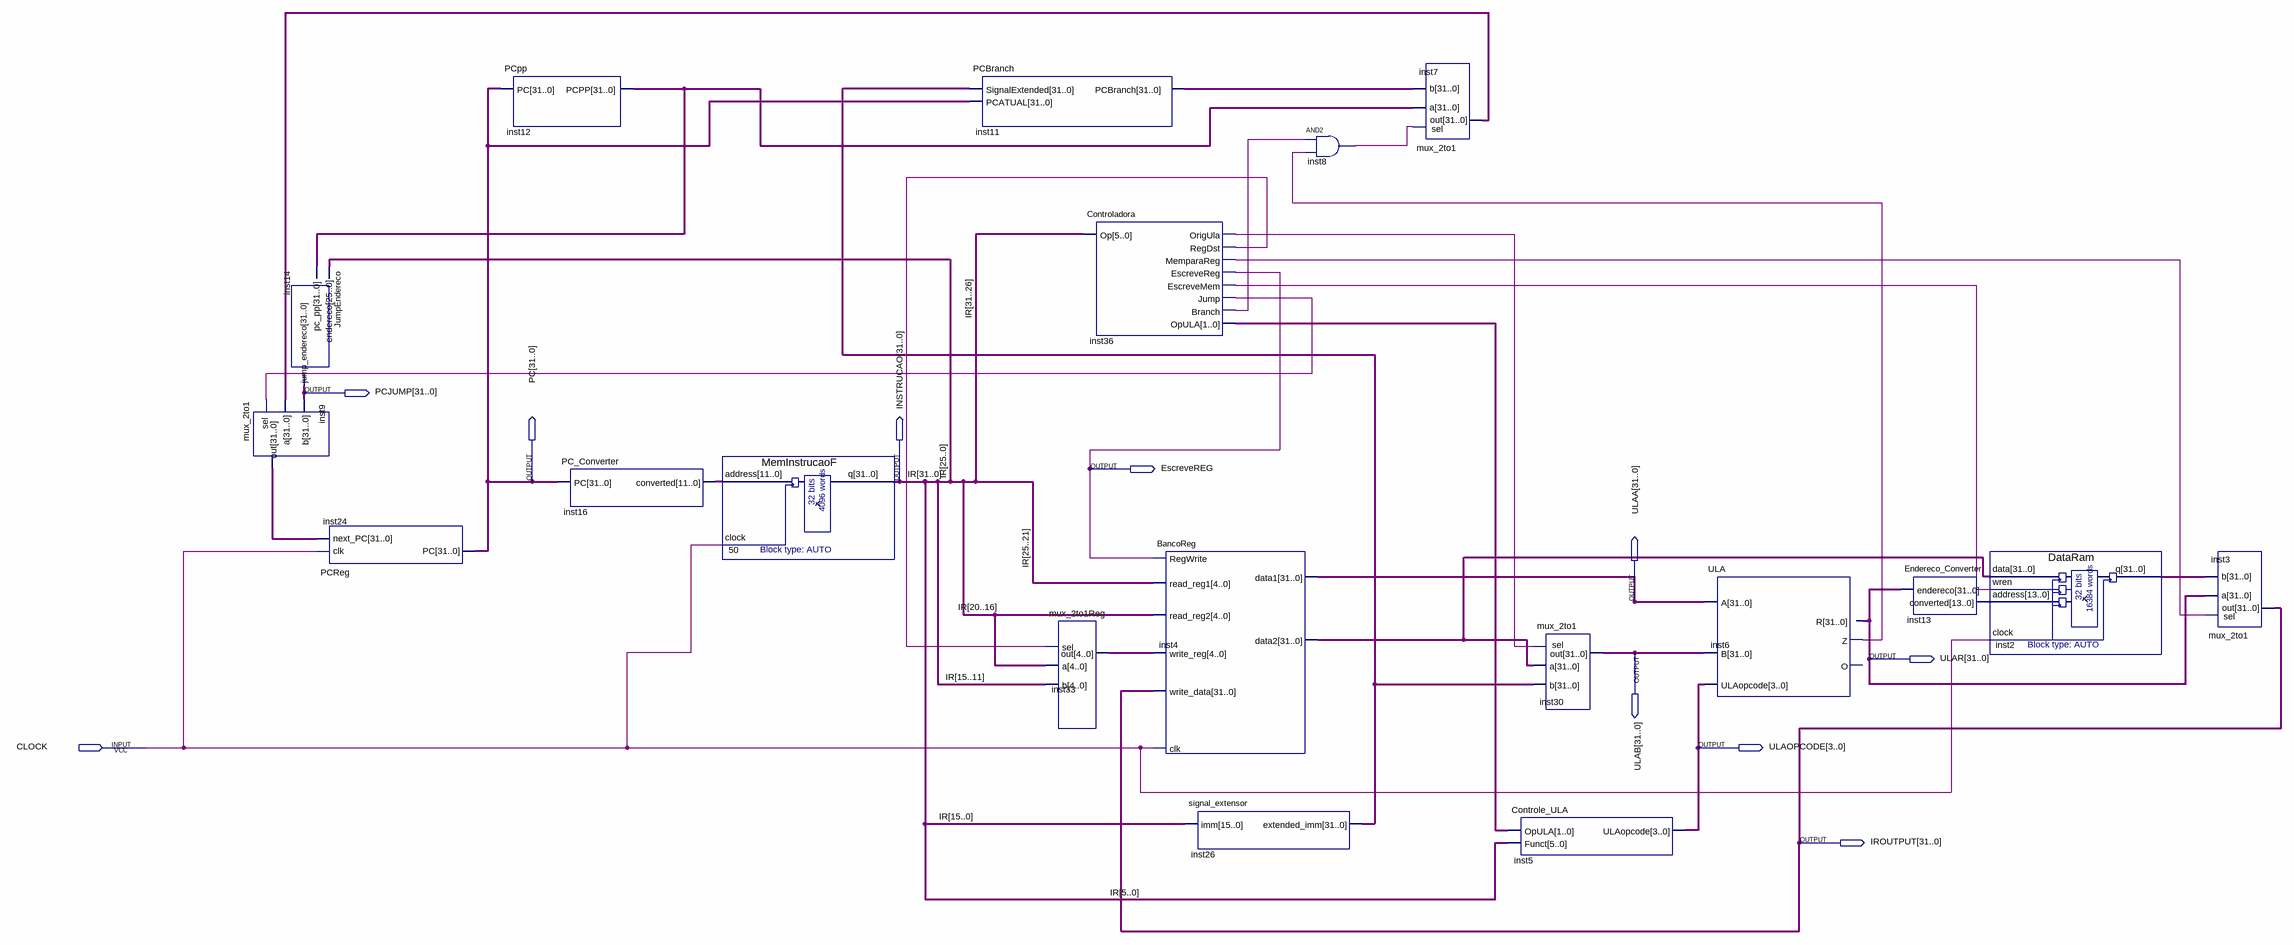
[diagram p0: schematic sheet]
// Quartus schematic test.bdf as structural Verilog: 19 symbols, 10 pins
module test (
  input  CLOCK,
  output [31:0] PCJUMP,
  output EscreveREG,
  output [31:0] PC,
  output [31:0] INSTRUCAO,
  output [31:0] ULAA,
  output [31:0] ULAB,
  output [31:0] ULAR,
  output [3:0] ULAOPCODE,
  output [31:0] IROUTPUT
);

  wire inst6_z, inst8_out, inst36_branch, inst36_escrevemem, inst36_jump, inst36_memparareg, inst36_origula,
       inst36_regdst;
  wire [1:0] inst36_opula;
  wire [4:0] inst33_out;
  wire [11:0] inst16_converted;
  wire [13:0] inst13_converted;
  wire [31:0] inst2_q, inst4_data2, inst7_out, inst9_out, inst11_pcbranch, inst12_pcpp, inst26_extended_imm;

  mux_2to1 inst9 (.a(inst7_out), .b(PCJUMP), .sel(inst36_jump), .out(inst9_out));
  JumpEndereco inst14 (.endereco(INSTRUCAO[25:0]), .pc_pp(inst12_pcpp), .jump_endereco(PCJUMP));
  PCReg inst24 (.clk(CLOCK), .next_PC(inst9_out), .PC(PC));
  PCpp inst12 (.PC(PC), .PCPP(inst12_pcpp));
  PC_Converter inst16 (.PC(PC), .converted(inst16_converted));
  MemInstrucaoF u_50 (.address(inst16_converted), .clock(CLOCK), .q(INSTRUCAO));
  PCBranch inst11 (.SignalExtended(inst26_extended_imm), .PCATUAL(PC), .PCBranch(inst11_pcbranch));
  mux_2to1Reg inst33 (.a(INSTRUCAO[20:16]), .b(INSTRUCAO[15:11]), .sel(inst36_regdst), .out(inst33_out));
  Controladora inst36 (
    .Op(INSTRUCAO[31:26]), .OrigUla(inst36_origula), .RegDst(inst36_regdst), .MemparaReg(inst36_memparareg),
    .EscreveReg(EscreveREG), .EscreveMem(inst36_escrevemem), .Jump(inst36_jump), .Branch(inst36_branch),
    .OpULA(inst36_opula));
  BancoReg inst4 (
    .clk(CLOCK), .RegWrite(EscreveREG), .read_reg1(INSTRUCAO[25:21]), .read_reg2(INSTRUCAO[20:16]),
    .write_reg(inst33_out), .write_data(IROUTPUT), .data1(ULAA), .data2(inst4_data2));
  signal_extensor inst26 (.imm(INSTRUCAO[15:0]), .extended_imm(inst26_extended_imm));
  and inst8 (inst8_out, inst36_branch, inst6_z);
  mux_2to1 inst7 (.a(inst12_pcpp), .b(inst11_pcbranch), .sel(inst8_out), .out(inst7_out));
  mux_2to1 inst30 (.a(inst4_data2), .b(inst26_extended_imm), .sel(inst36_origula), .out(ULAB));
  Controle_ULA inst5 (.OpULA(inst36_opula), .Funct(INSTRUCAO[5:0]), .ULAopcode(ULAOPCODE));
  ULA inst6 (.ULAopcode(ULAOPCODE), .A(ULAA), .B(ULAB), .R(ULAR), .Z(inst6_z));  // open: O
  Endereco_Converter inst13 (.endereco(ULAR), .converted(inst13_converted));
  DataRam inst2 (.data(inst4_data2), .wren(inst36_escrevemem), .address(inst13_converted), .clock(CLOCK), .q(inst2_q));
  mux_2to1 inst3 (.a(ULAR), .b(inst2_q), .sel(inst36_memparareg), .out(IROUTPUT));

  // Other names for the same wires on the sheet: IR[31:0] = INSTRUCAO
endmodule
